# Altium schematic sheet power.SchDoc: Oncilla motor control board
size A4; DocumentNumber: 4; Revision: 3; SheetNumber: 4; SheetTotal: 5
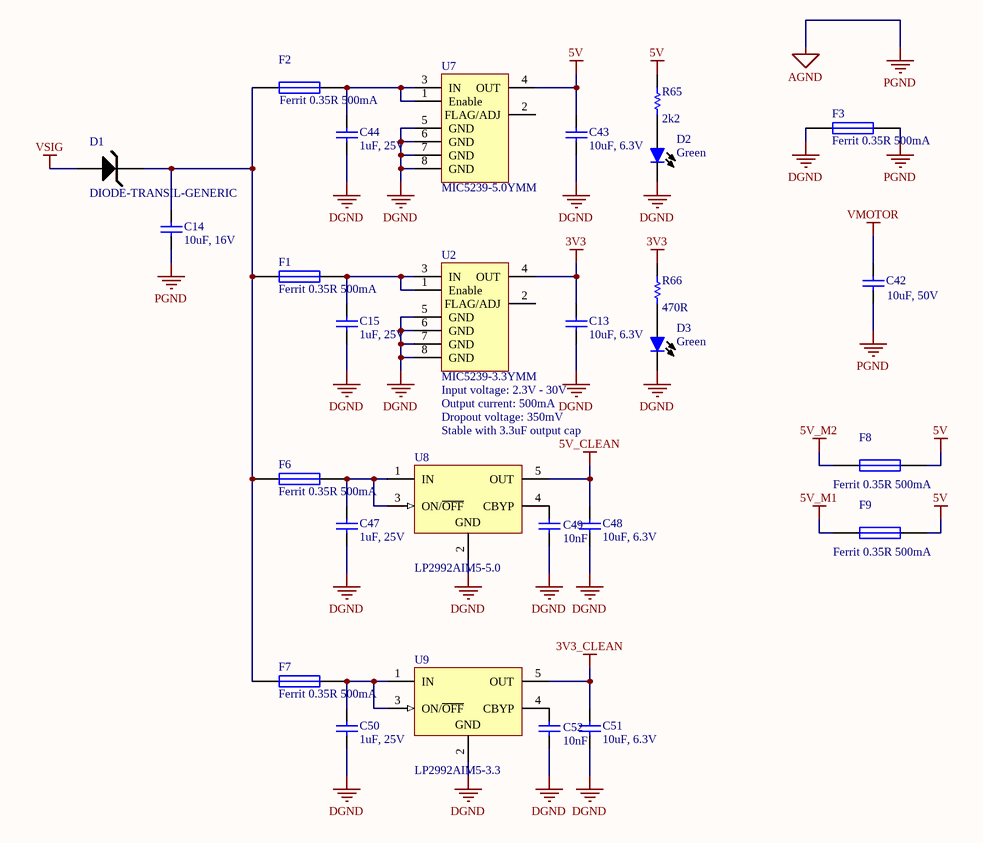
[diagram p0: power.SchDoc]

## Parts
C13  10uF, 6.3V  [CAPC1608L]
C14  10uF, 16V  [CAPC2512L]
C15  1uF, 25V  [CAPC2512L]
C42  10uF, 50V  [CAPC3216L]
C43  10uF, 6.3V  [CAPC1608L]
C44  1uF, 25V  [CAPC1608L]
C47  1uF, 25V  [CAPC1608L]
C48  10uF, 6.3V  [CAPC1608L]
C49  10nF  [CAPC1608L]
C50  1uF, 25V  [CAPC1608L]
C51  10uF, 6.3V  [CAPC1608L]
C52  10nF  [CAPC1608L]
D1  DIODE-TRANSIL-GENERIC  [DIODE-SMB]
D2  Color: Green  [CD1608-0603]  (hidden comment: LED Green)
D3  Color: Green  [CD1608-0603]  (hidden comment: LED Green)
F1  Ferrit 0.35R 500mA  [RESC1608L]
F2  Ferrit 0.35R 500mA  [RESC1608L]
F3  Ferrit 0.35R 500mA  [RESC1608L]
F6  Ferrit 0.35R 500mA  [RESC1608L]
F7  Ferrit 0.35R 500mA  [RESC1608L]
F8  Ferrit 0.35R 500mA  [RESC1608L]
F9  Ferrit 0.35R 500mA  [RESC1608L]
R65  2k2  [RESC1608L]
R66  470R  [RESC1608L]
U2  MIC5239-3.3YMM  [MSOP-8]
U7  MIC5239-5.0YMM  [MSOP-8]
U8  LP2992AIM5-5.0  [MF05A_N]
U9  LP2992AIM5-3.3  [MF05A_N]

## Nets
3V3: C13.2 R66.2 U2.4(OUT)
3V3_CLEAN: C51.2 U9.5(OUT)
5V: C43.2 F8.2 F9.2 R65.2 U7.4(OUT)
5V_CLEAN: C48.2 U8.5(OUT)
5V_M1: F9.1
5V_M2: F8.1
AGND: C14.1 C42.1 F3.2  [also labelled PGND]
DGND: C13.1 C15.1 C43.1 C44.1 C47.1 C48.1 C49.1 C50.1 C51.1 C52.1 D2.2(C) D3.2(C) F3.1 U2.5(GND) U2.6(GND) U2.7(GND) U2.8(GND) U7.5(GND) U7.6(GND) U7.7(GND) U7.8(GND) U8.2(GND) U9.2(GND)
VMOTOR: C42.2
VSIG: D1.A
NetC14_2: C14.2 D1.K F1.1 F2.1 F6.1 F7.1
NetC15_2: C15.2 F1.2 U2.1(Enable) U2.3(IN)
NetC44_2: C44.2 F2.2 U7.1(Enable) U7.3(IN)
NetC47_2: C47.2 F6.2 U8.1(IN) U8.3(ON/~{OFF})
NetC49_2: C49.2 U8.4(CBYP)
NetC50_2: C50.2 F7.2 U9.1(IN) U9.3(ON/~{OFF})
NetC52_2: C52.2 U9.4(CBYP)
NetD2_1: D2.1(A) R65.1
NetD3_1: D3.1(A) R66.1

Not connected (* = marked no-connect by the designer): U2 2(FLAG/ADJ); U7 2(FLAG/ADJ)

## Notes on the sheet
- (near U2) Input voltage: 2.3V - 30V
- Dropout voltage: 350mV
- (near U2) Output current: 500mA
- (near U8) Stable with 3.3uF output cap
- Title
- Size:
- Date:
- A4
- Number:
- Time:
- Revision:
- Sheet
- of
- File:

## Library data of the parts
C13-C15 C42-C44 C47-C52 = Cap Semi: Capacitor (Semiconductor SIM Model); Published: 8-Jun-2000; LatestRevisionDate: 29-May-2009; LatestRevisionNote: IPC-7351 Footprint Added.; PackageReference: C1206; Publisher: Altium Limited; PackageDescription: Chip Capacitor
  C13 C43 C48 C51: Value: 10uF, 6.3V
  C14: Value: 10uF, 16V
  C15 C44 C47 C50: Value: 1uF, 25V
  C42: Value: 10uF; Voltage: 50V
  C49 C52: Value: 10nF
D1 = DIODE-TRANSIL-GENERIC: GENERIC TRANSIL
D2 D3 = LED
F1-F3 F6-F9 = Fuse 1: Ferrit Bead; Published: 8-Jun-2000; LatestRevisionDate: 17-Jul-2002; LatestRevisionNote: Re-released for DXP Platform.; PackageReference: PIN-W2/E2.8; Publisher: Altium Limited
R65 R66 = Res Semi: Semiconductor Resistor; Published: 8-Jun-2000; LatestRevisionDate: 17-Jul-2002; LatestRevisionNote: Re-released for DXP Platform.; PackageReference: AXIAL-0.5; Publisher: Altium Limited
  R65: Value: 2k2
  R66: Value: 470R
U2 U7 = MIC5239: LDO, 500mA, Vin:2.3V-30V
U8 U9 = LP2992AIM5-5.0: Micropower 250 mA Low-Noise Ultra Low-Dropout Regulator in SOT-23 and LLP Packages; Manufacturer: National Semiconductor; CompType: LDO IC; PackageTopMarking: LFFA*XTT; PowerWise: N; Published: 4-Dec-2008; DatasheetVersion: May-2005; PackageVersion: revD, Aug-2008; PackageReference: MF05A; Publisher: Altium Limited; PackageDescription: Molded SOT-23, .115 x .063 x .040 in Body, 5 Lead, .0375 in Pitch; PartNumber: LP2992AIM5-5.0; RoHS: O; PinCount: 5; DigiKeyPartNumber: LP2992AIM5-5.0CT-ND; ComponentLink1Description: LP2992 Datasheet; ComponentLink1URL: http://www.national.com/ds/LP/LP2992.pdf; ComponentLink2Description: LP2992 Web Page; ComponentLink2URL: http://www.national.com/pf/LP/LP2992.html; ComponentLink3Description: MF05A Package Page; ComponentLink3URL: http://www.national.com/packaging/folders/mf05a.html